# Altium project Avionics Sensor Module.PrjPcb
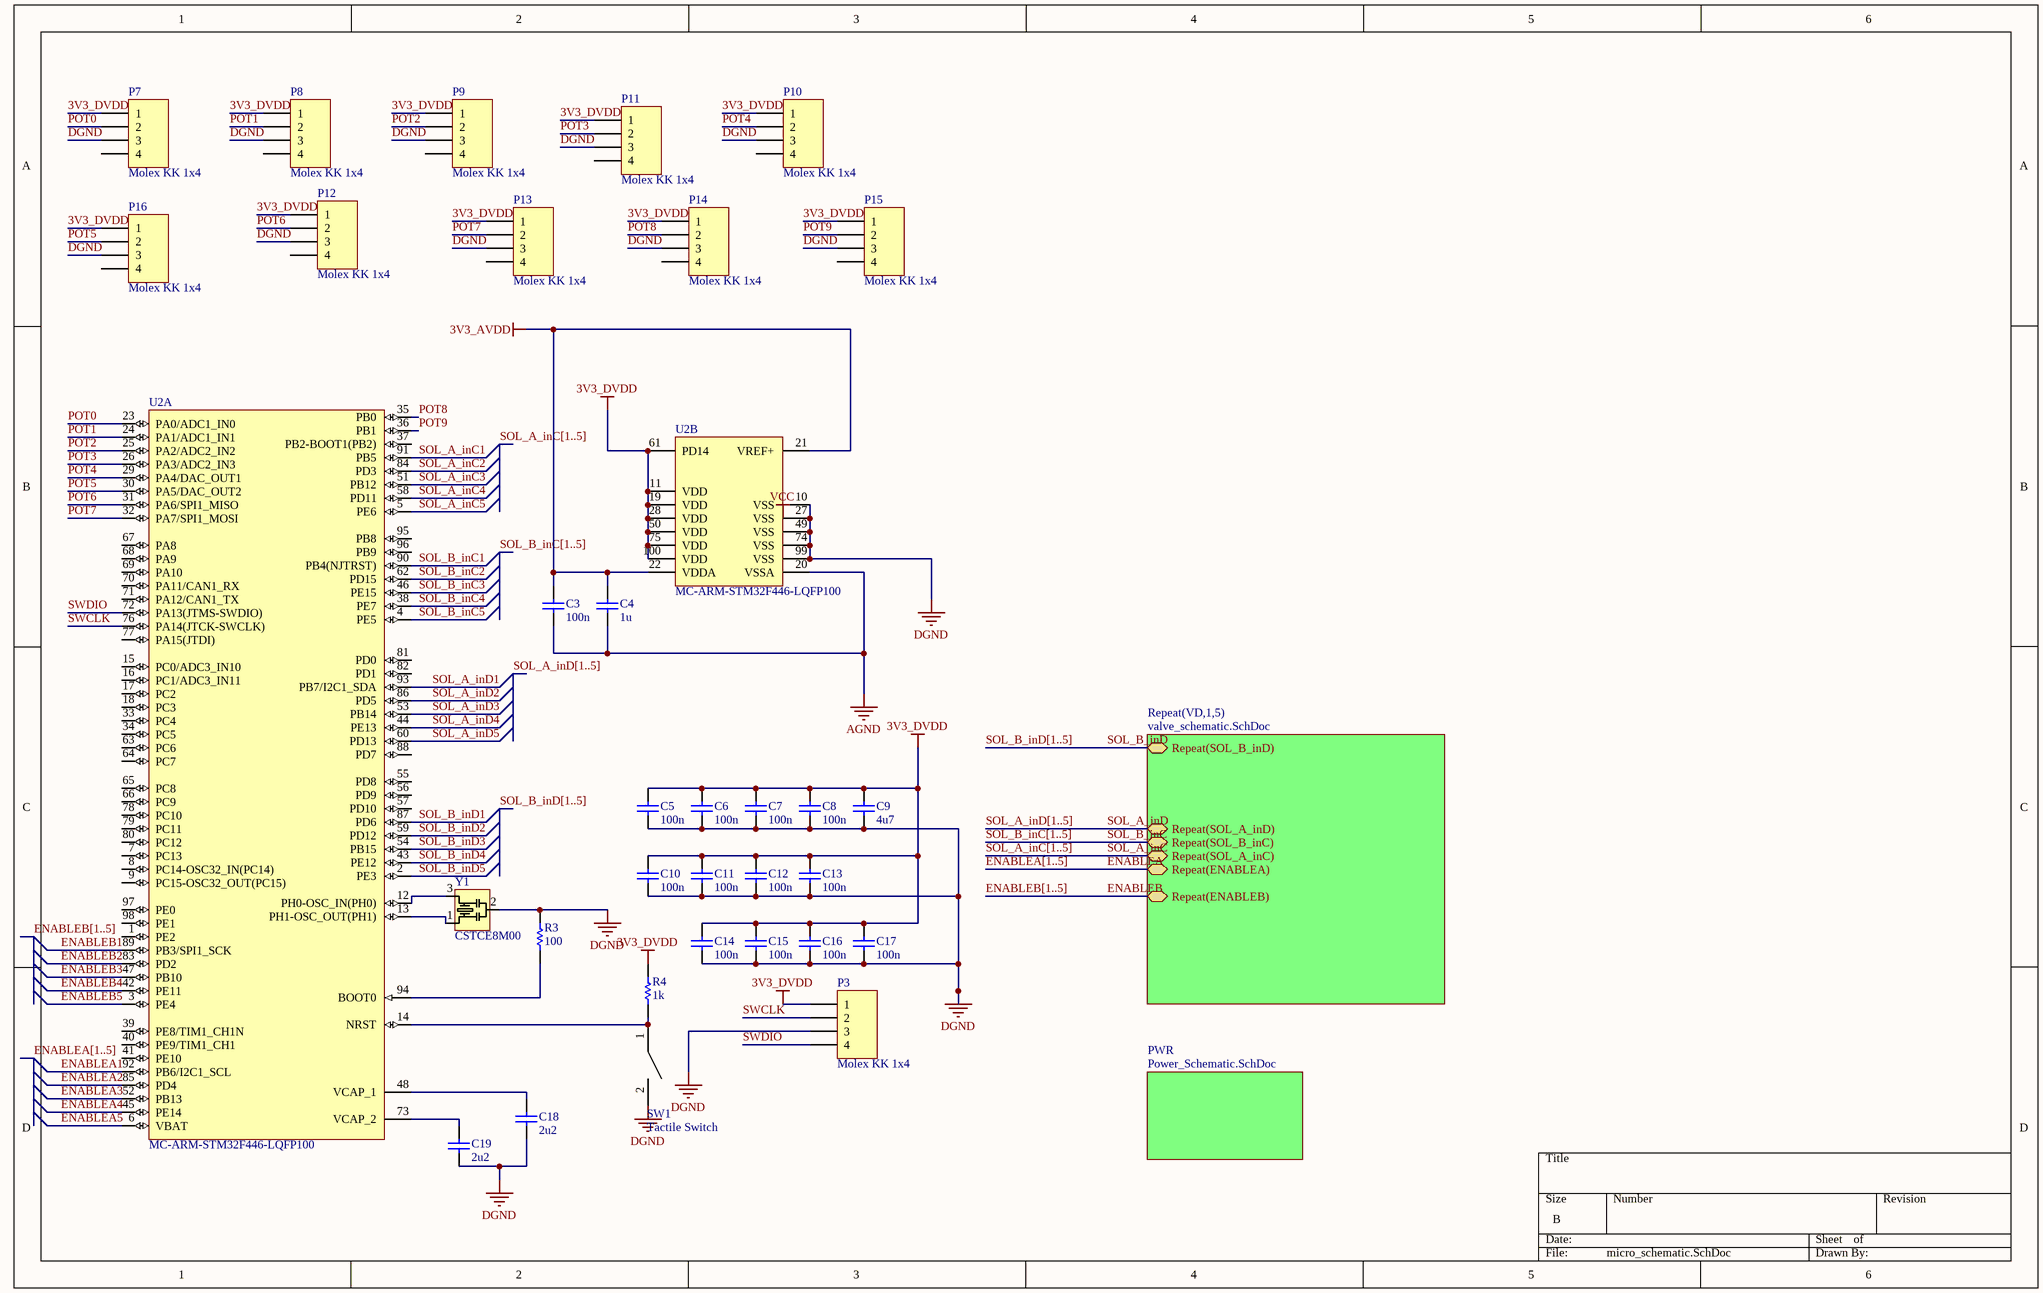
[diagram p0: micro_schematic.SchDoc]
3 sheets, 85 parts. Net scope: hierarchical (ports join the sheet entries above them; power ports are global).
Board file: valve_module.PcbDoc
Sheets:
  micro_schematic.SchDoc
    VD1 = valve_schematic.SchDoc
    VD2 = valve_schematic.SchDoc
    VD3 = valve_schematic.SchDoc
    VD4 = valve_schematic.SchDoc
    VD5 = valve_schematic.SchDoc
    PWR = Power_Schematic.SchDoc

## Sheet micro_schematic.SchDoc
size B

### Parts
C3  100n  [C0603]
C4  1u  [C0603]
C5  100n  [C0805]
C6  100n  [C0805]
C7  100n  [C0805]
C8  100n  [C0805]
C9  4u7  [C0805]
C10  100n  [C0805]
C11  100n  [C0805]
C12  100n  [C0805]
C13  100n  [C0805]
C14  100n  [C0805]
C15  100n  [C0805]
C16  100n  [C0805]
C17  100n  [C0805]
C18  2u2  [C0603]
C19  2u2  [C0603]
P3  Molex KK 1x4  [Molex KK 4x1]
P7  Molex KK 1x4  [Molex KK 4x1]
P8  Molex KK 1x4  [Molex KK 4x1]
P9  Molex KK 1x4  [Molex KK 4x1]
P10  Molex KK 1x4  [Molex KK 4x1]
P11  Molex KK 1x4  [Molex KK 4x1]
P12  Molex KK 1x4  [Molex KK 4x1]
P13  Molex KK 1x4  [Molex KK 4x1]
P14  Molex KK 1x4  [Molex KK 4x1]
P15  Molex KK 1x4  [Molex KK 4x1]
P16  Molex KK 1x4  [Molex KK 4x1]
R3  100  [R0805]
R4  1k  [R0805]
SW1  Tactile Switch  [Tactile Switch]
U2  MC-ARM-STM32F446-LQFP100  [STM-LQFP100_N]  (parts A,B of 2)
Y1  CSTCE8M00  [8MHz Ceramic Resonator]

### Sub-sheets
PWR = Power_Schematic.SchDoc: no entries
Repeat(VD,1,5) = valve_schematic.SchDoc: Repeat(SOL_B_inD), Repeat(SOL_A_inD), Repeat(SOL_B_inC), Repeat(SOL_A_inC), Repeat(ENABLEA), Repeat(ENABLEB)

### Nets
3V3_AVDD: C3.1 C4.1 U2.21(VREF+) U2.22(VDDA)
3V3_DVDD: C5.1 C6.1 C7.1 C8.1 C9.1 C10.1 C11.1 C12.1 C13.1 C14.1 C15.1 C16.1 C17.1 P3.1 P7.1 P8.1 P9.1 P10.1 P11.1 P12.1 P13.1 P14.1 P15.1 P16.1 R4.2 U2.11(VDD) U2.19(VDD) U2.28(VDD) U2.50(VDD) U2.61(PD14) U2.75(VDD) U2.100(VDD)
AGND: C3.2 C4.2 U2.20(VSSA)
DGND: C5.2 C6.2 C7.2 C8.2 C9.2 C10.2 C11.2 C12.2 C13.2 C14.2 C15.2 C16.2 C17.2 C18.2 C19.2 P3.3 P7.3 P8.3 P9.3 P10.3 P11.3 P12.3 P13.3 P14.3 P15.3 P16.3 R3.2 U2.10(VSS) U2.27(VSS) U2.49(VSS) U2.74(VSS) U2.99(VSS) Y1.2(GND)
ENABLEA: sheet Repeat(VD,1,5)/Repeat(ENABLEA)
ENABLEA1: U2.92(PB6/I2C1_SCL)  [project net ENABLEA]
ENABLEA2: U2.85(PD4)  [project net ENABLEA]
ENABLEA3: U2.52(PB13)  [project net ENABLEA]
ENABLEA4: U2.45(PE14)  [project net ENABLEA]
ENABLEA5: U2.6(VBAT)  [project net ENABLEA]
ENABLEB: sheet Repeat(VD,1,5)/Repeat(ENABLEB)
ENABLEB1: U2.89(PB3/SPI1_SCK)  [project net ENABLEB]
ENABLEB2: U2.83(PD2)  [project net ENABLEB]
ENABLEB3: U2.47(PB10)  [project net ENABLEB]
ENABLEB4: U2.42(PE11)  [project net ENABLEB]
ENABLEB5: U2.3(PE4)  [project net ENABLEB]
POT0: P7.2 U2.23(PA0/ADC1_IN0)
POT1: P8.2 U2.24(PA1/ADC1_IN1)
POT2: P9.2 U2.25(PA2/ADC2_IN2)
POT3: P11.2 U2.26(PA3/ADC2_IN3)
POT4: P10.2 U2.29(PA4/DAC_OUT1)
POT5: P16.2 U2.30(PA5/DAC_OUT2)
POT6: P12.2 U2.31(PA6/SPI1_MISO)
POT7: P13.2 U2.32(PA7/SPI1_MOSI)
POT8: P14.2 U2.35(PB0)
POT9: P15.2 U2.36(PB1)
SOL_A_inC: sheet Repeat(VD,1,5)/Repeat(SOL_A_inC)
SOL_A_inC1: U2.91(PB5)  [project net SOL_A_inC]
SOL_A_inC2: U2.84(PD3)  [project net SOL_A_inC]
SOL_A_inC3: U2.51(PB12)  [project net SOL_A_inC]
SOL_A_inC4: U2.58(PD11)  [project net SOL_A_inC]
SOL_A_inC5: U2.5(PE6)  [project net SOL_A_inC]
SOL_A_inD: sheet Repeat(VD,1,5)/Repeat(SOL_A_inD)
SOL_A_inD1: U2.93(PB7/I2C1_SDA)  [project net SOL_A_inD]
SOL_A_inD2: U2.86(PD5)  [project net SOL_A_inD]
SOL_A_inD3: U2.53(PB14)  [project net SOL_A_inD]
SOL_A_inD4: U2.44(PE13)  [project net SOL_A_inD]
SOL_A_inD5: U2.60(PD13)  [project net SOL_A_inD]
SOL_B_inC: sheet Repeat(VD,1,5)/Repeat(SOL_B_inC)
SOL_B_inC1: U2.90(PB4(NJTRST))  [project net SOL_B_inC]
SOL_B_inC2: U2.62(PD15)  [project net SOL_B_inC]
SOL_B_inC3: U2.46(PE15)  [project net SOL_B_inC]
SOL_B_inC4: U2.38(PE7)  [project net SOL_B_inC]
SOL_B_inC5: U2.4(PE5)  [project net SOL_B_inC]
SOL_B_inD: sheet Repeat(VD,1,5)/Repeat(SOL_B_inD)
SOL_B_inD1: U2.87(PD6)  [project net SOL_B_inD]
SOL_B_inD2: U2.59(PD12)  [project net SOL_B_inD]
SOL_B_inD3: U2.54(PB15)  [project net SOL_B_inD]
SOL_B_inD4: U2.43(PE12)  [project net SOL_B_inD]
SOL_B_inD5: U2.2(PE3)  [project net SOL_B_inD]
SWCLK: P3.2 U2.76(PA14(JTCK-SWCLK))
SWDIO: P3.4 U2.72(PA13(JTMS-SWDIO))
NetC18_1: C18.1 U2.48(VCAP_1)
NetC19_1: C19.1 U2.73(VCAP_2)
NetR3_1: R3.1 U2.94(BOOT0)
NetR4_1: R4.1 SW1.1 U2.14(NRST)
NetU2_12: U2.12(PH0-OSC_IN(PH0)) Y1.3(OSC2)
NetU2_13: U2.13(PH1-OSC_OUT(PH1)) Y1.1(OSC1)

Not connected (* = marked no-connect by the designer): P7 4; P8 4; P9 4; P10 4; P11 4; P12 4; P13 4; P14 4; P15 4; P16 4; SW1 2(1); U2 1(PE2) 7(PC13) 8(PC14-OSC32_IN(PC14)) 9(PC15-OSC32_OUT(PC15)) 15(PC0/ADC3_IN10) 16(PC1/ADC3_IN11) 17(PC2) 18(PC3) 33(PC4) 34(PC5) 37(PB2-BOOT1(PB2)) 39(PE8/TIM1_CH1N) 40(PE9/TIM1_CH1) 41(PE10) 55(PD8) 56(PD9) 57(PD10) 63(PC6) 64(PC7) 65(PC8) 66(PC9) 67(PA8) 68(PA9) 69(PA10) 70(PA11/CAN1_RX) 71(PA12/CAN1_TX) 77(PA15(JTDI)) 78(PC10) 79(PC11) 80(PC12) 81(PD0) 82(PD1) 88(PD7) 95(PB8) 96(PB9) 97(PE0) 98(PE1)

### Buses and harness runs
bus ENABLEA[1..5]
bus ENABLEB[1..5]
bus SOL_A_inC[1..5]
bus SOL_A_inD[1..5]
bus SOL_B_inC[1..5]
bus SOL_B_inD[1..5]

### Notes on the sheet
- Labels drawn without touching a wire or pin: DGND, VCC

### Library data of the parts
C3 C4 C18 C19 = C0603: 0603 Capacitor
  C3: Value: 100n
  C4: Value: 1u
  C18 C19: Value: 2u2
C5-C17 = C0805: 0805 Capacitor
  C5-C8 C10-C17: Value: 100n
  C9: Value: 4u7
P3 P7-P16 = Molex KK 1x4: 1x4 Molex KK Connector
R3 R4 = R0805: RESISTOR 0805
  R3: Value: 100
  R4: Value: 1k
SW1 = Tactile Switch: TL3301AF160QG
Y1 = CSTCE8M00: 8MHz Ceramic Resonator

## Sheet valve_schematic.SchDoc
size A
Used 5 times, as channels VD1, VD2, VD3, VD4, VD5. Parts and nets are listed once, with the designators drawn on the sheet.
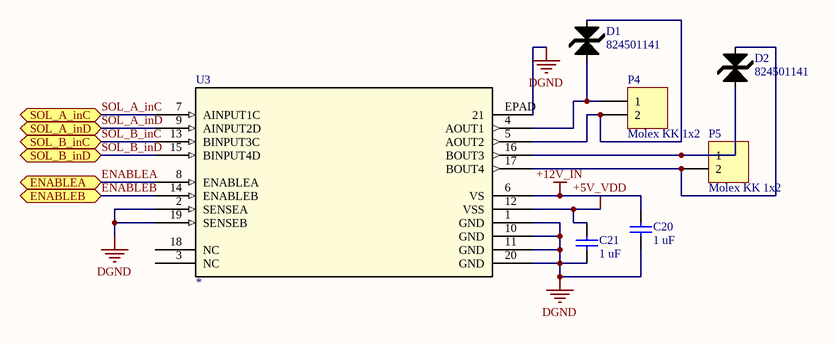
[diagram p1: valve_schematic.SchDoc]

### Parts
C20  1 uF  [C0603]
C21  1 uF  [C0603]
D1  824501141  [DIODE-SMA]
D2  824501141  [DIODE-SMA]
P4  Molex KK 1x2  [Molex KK 2x1]
P5  Molex KK 1x2  [Molex KK 2x1]
U3  *  [PowerSO-20]

### Ports
ENABLEA, ENABLEB, SOL_A_inC, SOL_A_inD, SOL_B_inC, SOL_B_inD

### Nets
+5V_VDD: C21.1 U3.12(VSS)
+12V_IN: C20.1 U3.6(VS)
DGND: C20.2 C21.2 U3.1(GND) U3.2(SENSEA) U3.10(GND) U3.11(GND) U3.19(SENSEB) U3.20(GND) U3.EPAD(21)
ENABLEA: U3.8(ENABLEA) ; port ENABLEA
ENABLEB: U3.14(ENABLEB) ; port ENABLEB
SOL_A_inC: U3.7(AINPUT1C) ; port SOL_A_inC
SOL_A_inD: U3.9(AINPUT2D) ; port SOL_A_inD
SOL_B_inC: U3.13(BINPUT3C) ; port SOL_B_inC
SOL_B_inD: U3.15(BINPUT4D) ; port SOL_B_inD
NetD1_A: D1.A P4.1 U3.4(AOUT1)
NetD1_K: D1.K P4.2 U3.5(AOUT2)
NetD2_A: D2.A P5.1 U3.16(BOUT3)
NetD2_K: D2.K P5.2 U3.17(BOUT4)

Not connected (* = marked no-connect by the designer): U3 3(NC) 18(NC)

### Channels
VD1: designators end in _VD1; ports ENABLEA=ENABLEA ENABLEB=ENABLEB SOL_A_inC=SOL_A_inC SOL_A_inD=SOL_A_inD SOL_B_inC=SOL_B_inC SOL_B_inD=SOL_B_inD
VD2: designators end in _VD2; ports ENABLEA=ENABLEA ENABLEB=ENABLEB SOL_A_inC=SOL_A_inC SOL_A_inD=SOL_A_inD SOL_B_inC=SOL_B_inC SOL_B_inD=SOL_B_inD
VD3: designators end in _VD3; ports ENABLEA=ENABLEA ENABLEB=ENABLEB SOL_A_inC=SOL_A_inC SOL_A_inD=SOL_A_inD SOL_B_inC=SOL_B_inC SOL_B_inD=SOL_B_inD
VD4: designators end in _VD4; ports ENABLEA=ENABLEA ENABLEB=ENABLEB SOL_A_inC=SOL_A_inC SOL_A_inD=SOL_A_inD SOL_B_inC=SOL_B_inC SOL_B_inD=SOL_B_inD
VD5: designators end in _VD5; ports ENABLEA=ENABLEA ENABLEB=ENABLEB SOL_A_inC=SOL_A_inC SOL_A_inD=SOL_A_inD SOL_B_inC=SOL_B_inC SOL_B_inD=SOL_B_inD

### Library data of the parts
C20 C21 = C0603: 0603 Capacitor; Value: 1 uF
D1 D2 = 824501141: TVS DIODE 14V 23.2V DO214AC; Supplier 1: Digi-Key; Supplier Part Number 1: SMCJ120CABTR-ND
P4 P5 = Molex KK 1x2: 1x2 Molex KK Connector
U3 = L298P013TR: Imported; Vendor: ST Microelectronics; Built_By: EMA_UL_Team; C: Copyright (C) 2015 Accelerated Designs. All rights reserved; Manufacturer_Part_Number: L298P013TR; Value: Value; Type: Type; RefDes: RefDes

## Sheet Power_Schematic.SchDoc
size A
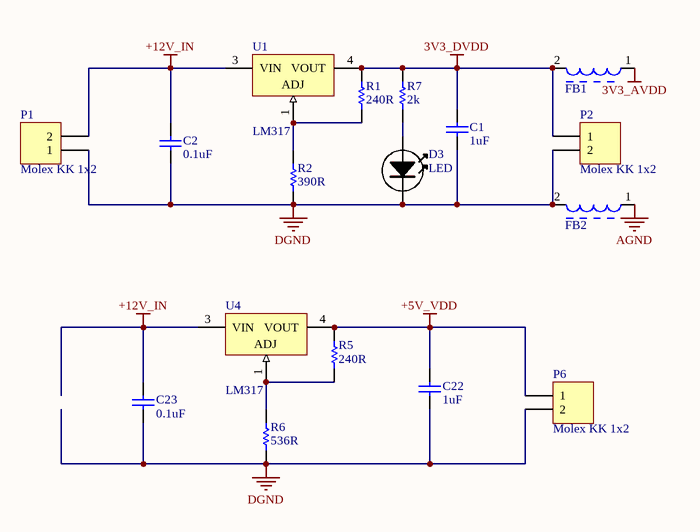
[diagram p2: Power_Schematic.SchDoc]

### Parts
C1  1uF  [C0805]
C2  0.1uF  [C0805]
C22  1uF  [C0805]
C23  0.1uF  [C0805]
D3  LED  [0805LED]
FB1  FERRITE  [R0805]  (value not drawn)
FB2  FERRITE  [R0805]  (value not drawn)
P1  Molex KK 1x2  [Molex KK 2x1]
P2  Molex KK 1x2  [Molex KK 2x1]
P6  Molex KK 1x2  [Molex KK 2x1]
R1  240R  [R0805]
R2  390R  [R0805]
R5  240R  [R0805]
R6  536R  [R0805]
R7  2k  [R0805]
U1  LM317  [D-PAK]
U4  LM317  [D-PAK]

### Nets
3V3_AVDD: FB1.1
3V3_DVDD: C1.1 FB1.2 P2.1 R1.2 R7.2 U1.4(VOUT)
+5V_VDD: C22.1 P6.1 R5.2 U4.4(VOUT)
+12V_IN: C2.1 C23.1 P1.2 U1.3(VIN) U4.3(VIN)
AGND: FB2.1
DGND: C1.2 C2.2 C22.2 C23.2 D3.K FB2.2 P1.1 P2.2 P6.2 R2.1 R6.1
NetD3_A: D3.A R7.1
NetR1_1: R1.1 R2.2 U1.1(ADJ)
NetR5_1: R5.1 R6.2 U4.1(ADJ)

### Library data of the parts
C1 C2 C22 C23 = C0805: 0805 Capacitor
  C1 C22: Value: 1uF
  C2 C23: Value: 0.1uF
D3 = LED: Manufacturer: OSRAM Opto Semiconductors Inc; Manufacturer Part Number: LS T676-Q1R2-1-Z; Reel: D13
FB1 FB2 = FERRITE: FERRITE BEAD 0805
P1 P2 P6 = Molex KK 1x2: 1x2 Molex KK Connector
R1 R2 R5-R7 = R0805: RESISTOR 0805
  R1 R5: Value: 240R
  R2: Value: 390R
  R6: Value: 536R
  R7: Value: 2k
U1 U4 = LM317: Linear Voltage Regulator

## Nets that join several sheets
3V3_AVDD: micro_schematic (C3.1 C4.1 U2.21 U2.22), Power_Schematic (FB1.1)
3V3_DVDD: micro_schematic (32 pins), Power_Schematic (6 pins)
+5V_VDD: VD1 (C21_VD1.1 U3_VD1.12), VD2 (C21_VD2.1 U3_VD2.12), VD3 (C21_VD3.1 U3_VD3.12), VD4 (C21_VD4.1 U3_VD4.12), VD5 (C21_VD5.1 U3_VD5.12), Power_Schematic (C22.1 P6.1 R5.2 U4.4)
+12V_IN: VD1 (C20_VD1.1 U3_VD1.6), VD2 (C20_VD2.1 U3_VD2.6), VD3 (C20_VD3.1 U3_VD3.6), VD4 (C20_VD4.1 U3_VD4.6), VD5 (C20_VD5.1 U3_VD5.6), Power_Schematic (5 pins)
AGND: micro_schematic (C3.2 C4.2 U2.20), Power_Schematic (FB2.1)
DGND: micro_schematic (33 pins), VD1 (9 pins), VD2 (9 pins), VD3 (9 pins), VD4 (9 pins), VD5 (9 pins), Power_Schematic (11 pins)
ENABLEA: micro_schematic (U2.92), VD1 (U3_VD1.8)
ENABLEA: micro_schematic (U2.85), VD2 (U3_VD2.8)
ENABLEA: micro_schematic (U2.52), VD3 (U3_VD3.8)
ENABLEA: micro_schematic (U2.45), VD4 (U3_VD4.8)
ENABLEA: micro_schematic (U2.6), VD5 (U3_VD5.8)
ENABLEB: micro_schematic (U2.89), VD1 (U3_VD1.14)
ENABLEB: micro_schematic (U2.83), VD2 (U3_VD2.14)
ENABLEB: micro_schematic (U2.47), VD3 (U3_VD3.14)
ENABLEB: micro_schematic (U2.42), VD4 (U3_VD4.14)
ENABLEB: micro_schematic (U2.3), VD5 (U3_VD5.14)
SOL_A_inC: micro_schematic (U2.91), VD1 (U3_VD1.7)
SOL_A_inC: micro_schematic (U2.84), VD2 (U3_VD2.7)
SOL_A_inC: micro_schematic (U2.51), VD3 (U3_VD3.7)
SOL_A_inC: micro_schematic (U2.58), VD4 (U3_VD4.7)
SOL_A_inC: micro_schematic (U2.5), VD5 (U3_VD5.7)
SOL_A_inD: micro_schematic (U2.93), VD1 (U3_VD1.9)
SOL_A_inD: micro_schematic (U2.86), VD2 (U3_VD2.9)
SOL_A_inD: micro_schematic (U2.53), VD3 (U3_VD3.9)
SOL_A_inD: micro_schematic (U2.44), VD4 (U3_VD4.9)
SOL_A_inD: micro_schematic (U2.60), VD5 (U3_VD5.9)
SOL_B_inC: micro_schematic (U2.90), VD1 (U3_VD1.13)
SOL_B_inC: micro_schematic (U2.62), VD2 (U3_VD2.13)
SOL_B_inC: micro_schematic (U2.46), VD3 (U3_VD3.13)
SOL_B_inC: micro_schematic (U2.38), VD4 (U3_VD4.13)
SOL_B_inC: micro_schematic (U2.4), VD5 (U3_VD5.13)
SOL_B_inD: micro_schematic (U2.87), VD1 (U3_VD1.15)
SOL_B_inD: micro_schematic (U2.59), VD2 (U3_VD2.15)
SOL_B_inD: micro_schematic (U2.54), VD3 (U3_VD3.15)
SOL_B_inD: micro_schematic (U2.43), VD4 (U3_VD4.15)
SOL_B_inD: micro_schematic (U2.2), VD5 (U3_VD5.15)